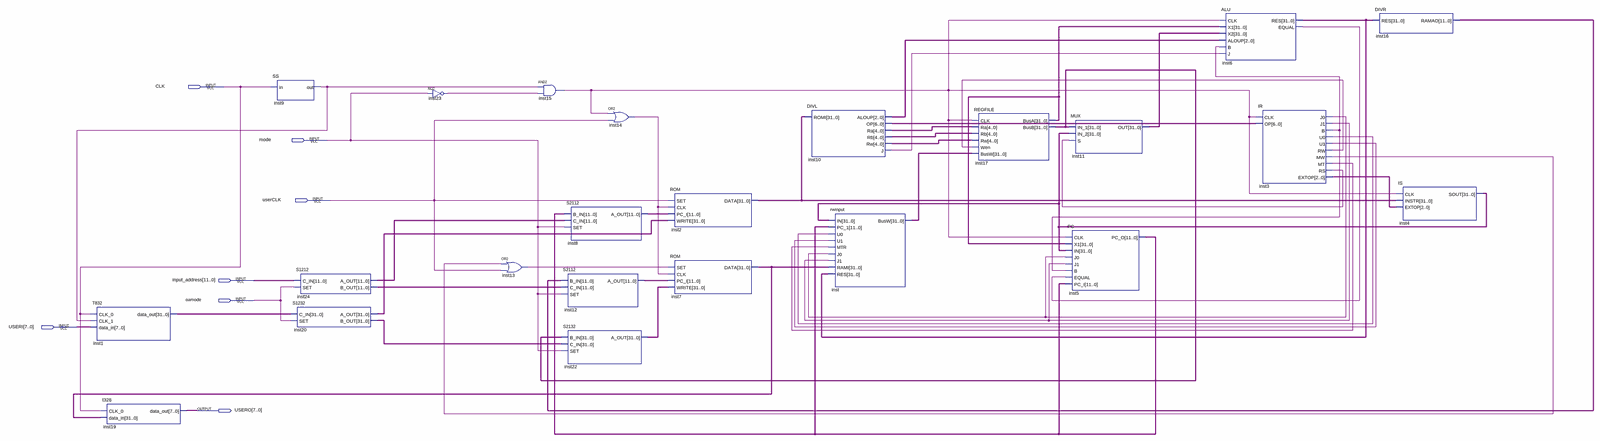
[diagram p0: schematic sheet, whole]
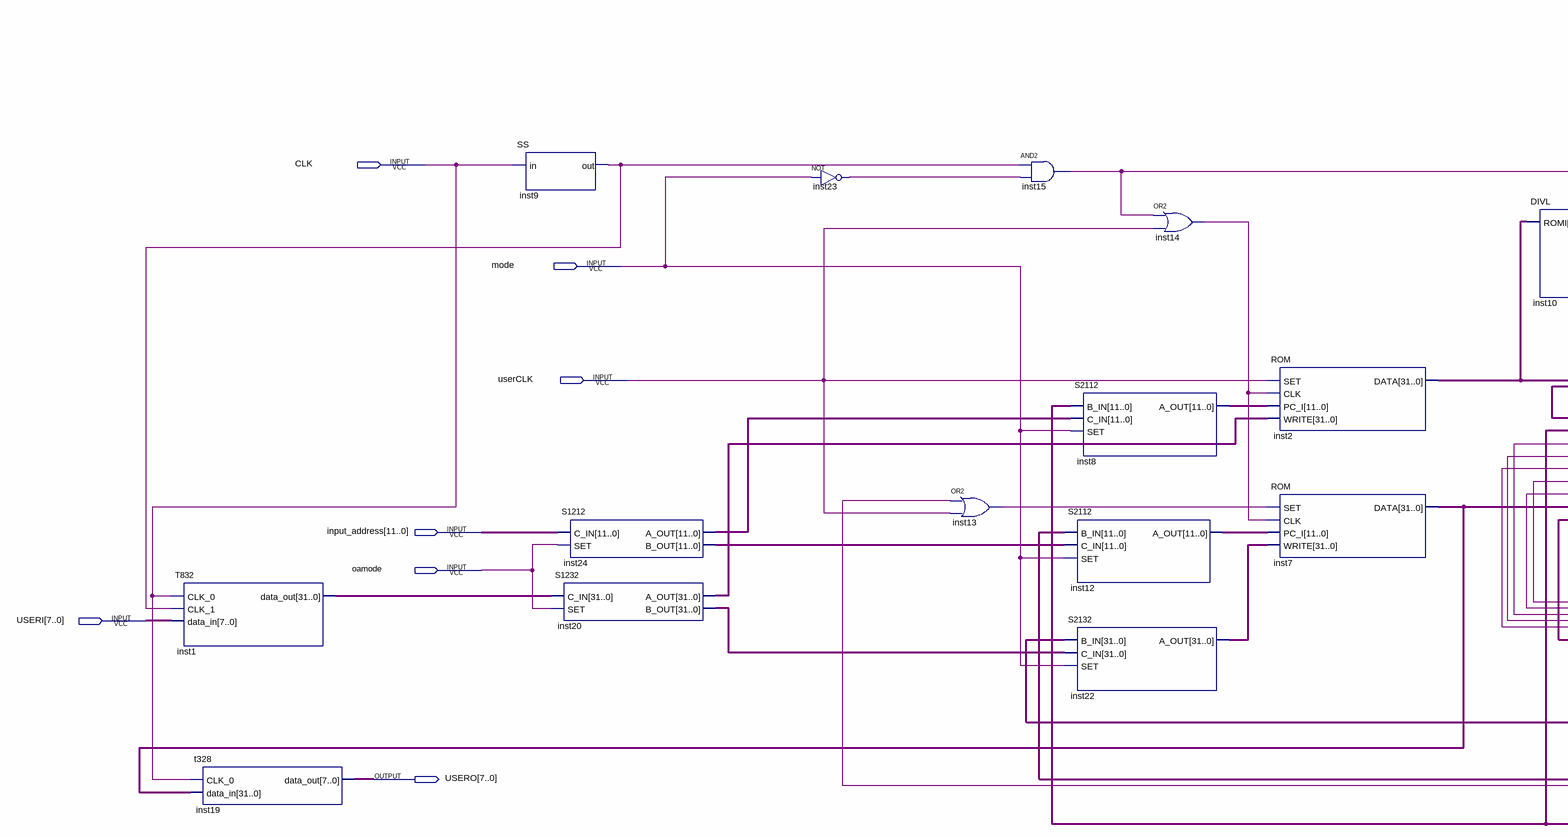
[diagram p1: schematic sheet, left part]
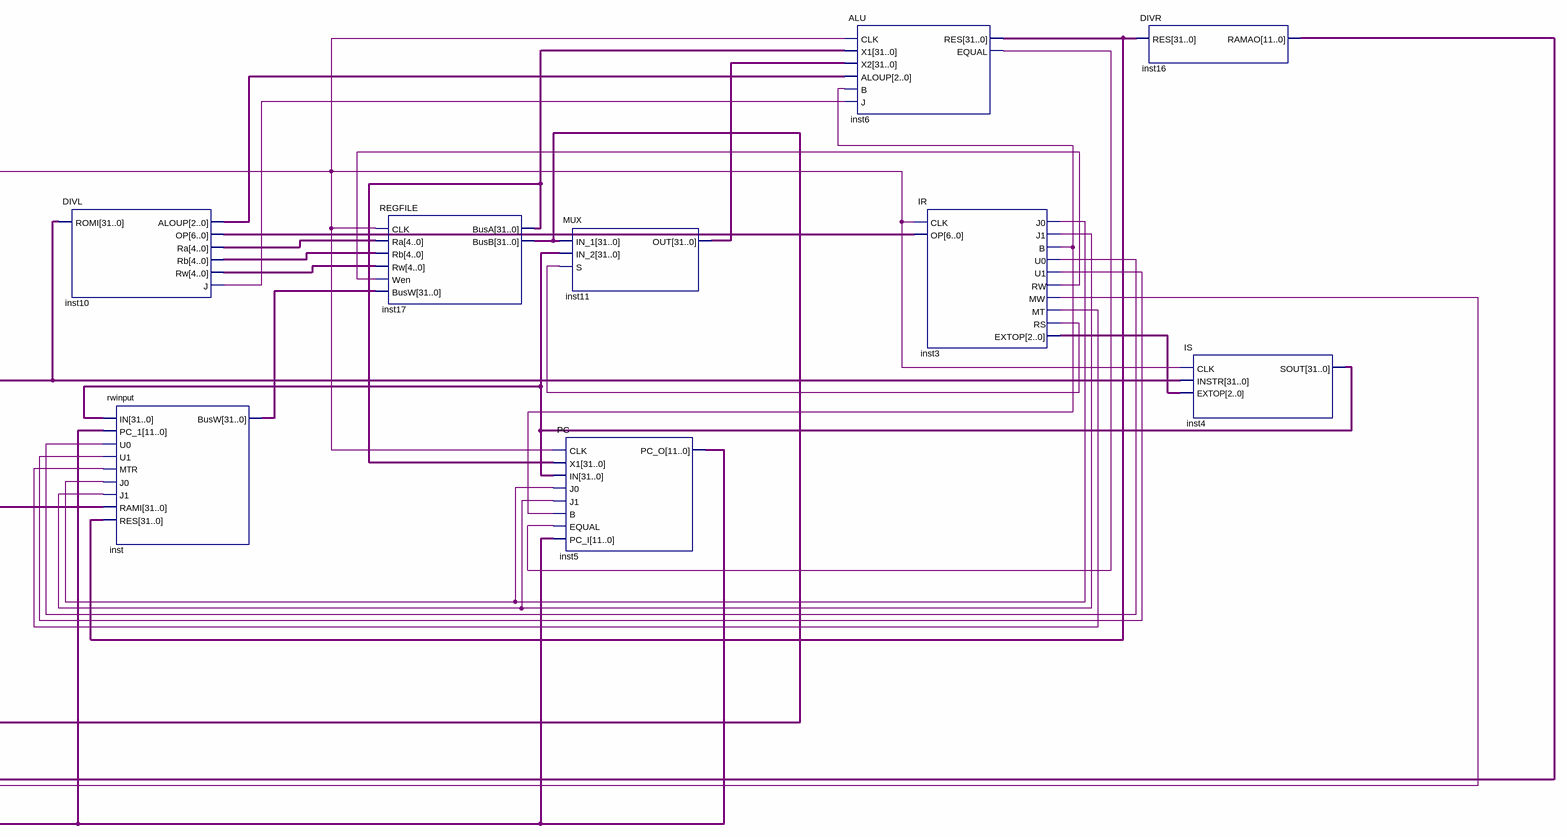
[diagram p2: schematic sheet, right part]
// Quartus schematic cpu.bdf as structural Verilog: 23 symbols, 7 pins
module cpu (
  input  CLK,
  input  mode,
  input  userCLK,
  input  [11:0] input_address,
  input  oamode,
  input  [7:0] USERI,
  output [7:0] USERO
);

  wire inst3_b, inst3_j0, inst3_j1, inst3_mt, inst3_mw, inst3_rs, inst3_rw, inst3_u0, inst3_u1, inst6_equal,
       inst9_out, inst10_j, inst13_out, inst14_out, inst15_out, inst23_out;
  wire [2:0] inst3_extop, inst10_aloup;
  wire [4:0] inst10_ra, inst10_rb, inst10_rw;
  wire [6:0] inst10_op;
  wire [11:0] inst5_pc_o, inst8_a_out, inst12_a_out, inst16_ramao, inst24_a_out, inst24_b_out;
  wire [31:0] inst1_data_out, inst2_data, inst4_sout, inst6_res, inst7_data, inst11_out, inst17_busa,
       inst17_busb, inst20_a_out, inst20_b_out, inst22_a_out, inst_busw;

  T832 inst1 (.CLK_0(CLK), .CLK_1(inst9_out), .data_in(USERI), .data_out(inst1_data_out));
  t328 inst19 (.CLK_0(CLK), .data_in(inst7_data), .data_out(USERO));
  SS inst9 (.in(CLK), .out(inst9_out));
  S1212 inst24 (.C_IN(input_address), .SET(oamode), .A_OUT(inst24_a_out), .B_OUT(inst24_b_out));
  S1232 inst20 (.C_IN(inst1_data_out), .SET(oamode), .A_OUT(inst20_a_out), .B_OUT(inst20_b_out));
  not inst23 (inst23_out, mode);
  or inst13 (inst13_out, inst3_mw, userCLK);
  and inst15 (inst15_out, inst9_out, inst23_out);
  S2112 inst8 (.B_IN(inst5_pc_o), .C_IN(inst24_a_out), .SET(mode), .A_OUT(inst8_a_out));
  S2112 inst12 (.B_IN(inst16_ramao), .C_IN(inst24_b_out), .SET(mode), .A_OUT(inst12_a_out));
  S2132 inst22 (.B_IN(inst17_busb), .C_IN(inst20_b_out), .SET(mode), .A_OUT(inst22_a_out));
  or inst14 (inst14_out, inst15_out, userCLK);
  ROM inst2 (.SET(userCLK), .CLK(inst14_out), .PC_I(inst8_a_out), .WRITE(inst20_a_out), .DATA(inst2_data));
  ROM inst7 (.SET(inst13_out), .CLK(inst14_out), .PC_I(inst12_a_out), .WRITE(inst22_a_out), .DATA(inst7_data));
  DIVL inst10 (
    .ROMI(inst2_data), .ALOUP(inst10_aloup), .OP(inst10_op), .Ra(inst10_ra), .Rb(inst10_rb), .Rw(inst10_rw),
    .J(inst10_j));
  rwinput inst (
    .IN(inst4_sout), .PC_1(inst5_pc_o), .U0(inst3_u0), .U1(inst3_u1), .MTR(inst3_mt), .J0(inst3_j0),
    .J1(inst3_j1), .RAMI(inst7_data), .RES(inst6_res), .BusW(inst_busw));
  REGFILE inst17 (
    .CLK(inst15_out), .Ra(inst10_ra), .Rb(inst10_rb), .Rw(inst10_rw), .Wen(inst3_rw), .BusW(inst_busw),
    .BusA(inst17_busa), .BusB(inst17_busb));
  MUX inst11 (.IN_1(inst17_busb), .IN_2(inst4_sout), .S(inst3_rs), .OUT(inst11_out));
  PC inst5 (
    .CLK(inst15_out), .X1(inst17_busa), .IN(inst4_sout), .J0(inst3_j0), .J1(inst3_j1), .B(inst3_b),
    .EQUAL(inst6_equal), .PC_I(inst5_pc_o), .PC_O(inst5_pc_o));
  ALU inst6 (
    .CLK(inst15_out), .X1(inst17_busa), .X2(inst11_out), .ALOUP(inst10_aloup), .B(inst3_b), .J(inst10_j),
    .RES(inst6_res), .EQUAL(inst6_equal));
  IR inst3 (
    .CLK(inst15_out), .OP(inst10_op), .J0(inst3_j0), .J1(inst3_j1), .B(inst3_b), .U0(inst3_u0),
    .U1(inst3_u1), .RW(inst3_rw), .MW(inst3_mw), .MT(inst3_mt), .RS(inst3_rs), .EXTOP(inst3_extop));
  DIVR inst16 (.RES(inst6_res), .RAMAO(inst16_ramao));
  IS inst4 (.CLK(inst15_out), .INSTR(inst2_data), .EXTOP(inst3_extop), .SOUT(inst4_sout));
endmodule
